# Altium schematic sheet digital.SchDoc
size B; SheetNumber: 2; SheetTotal: 3
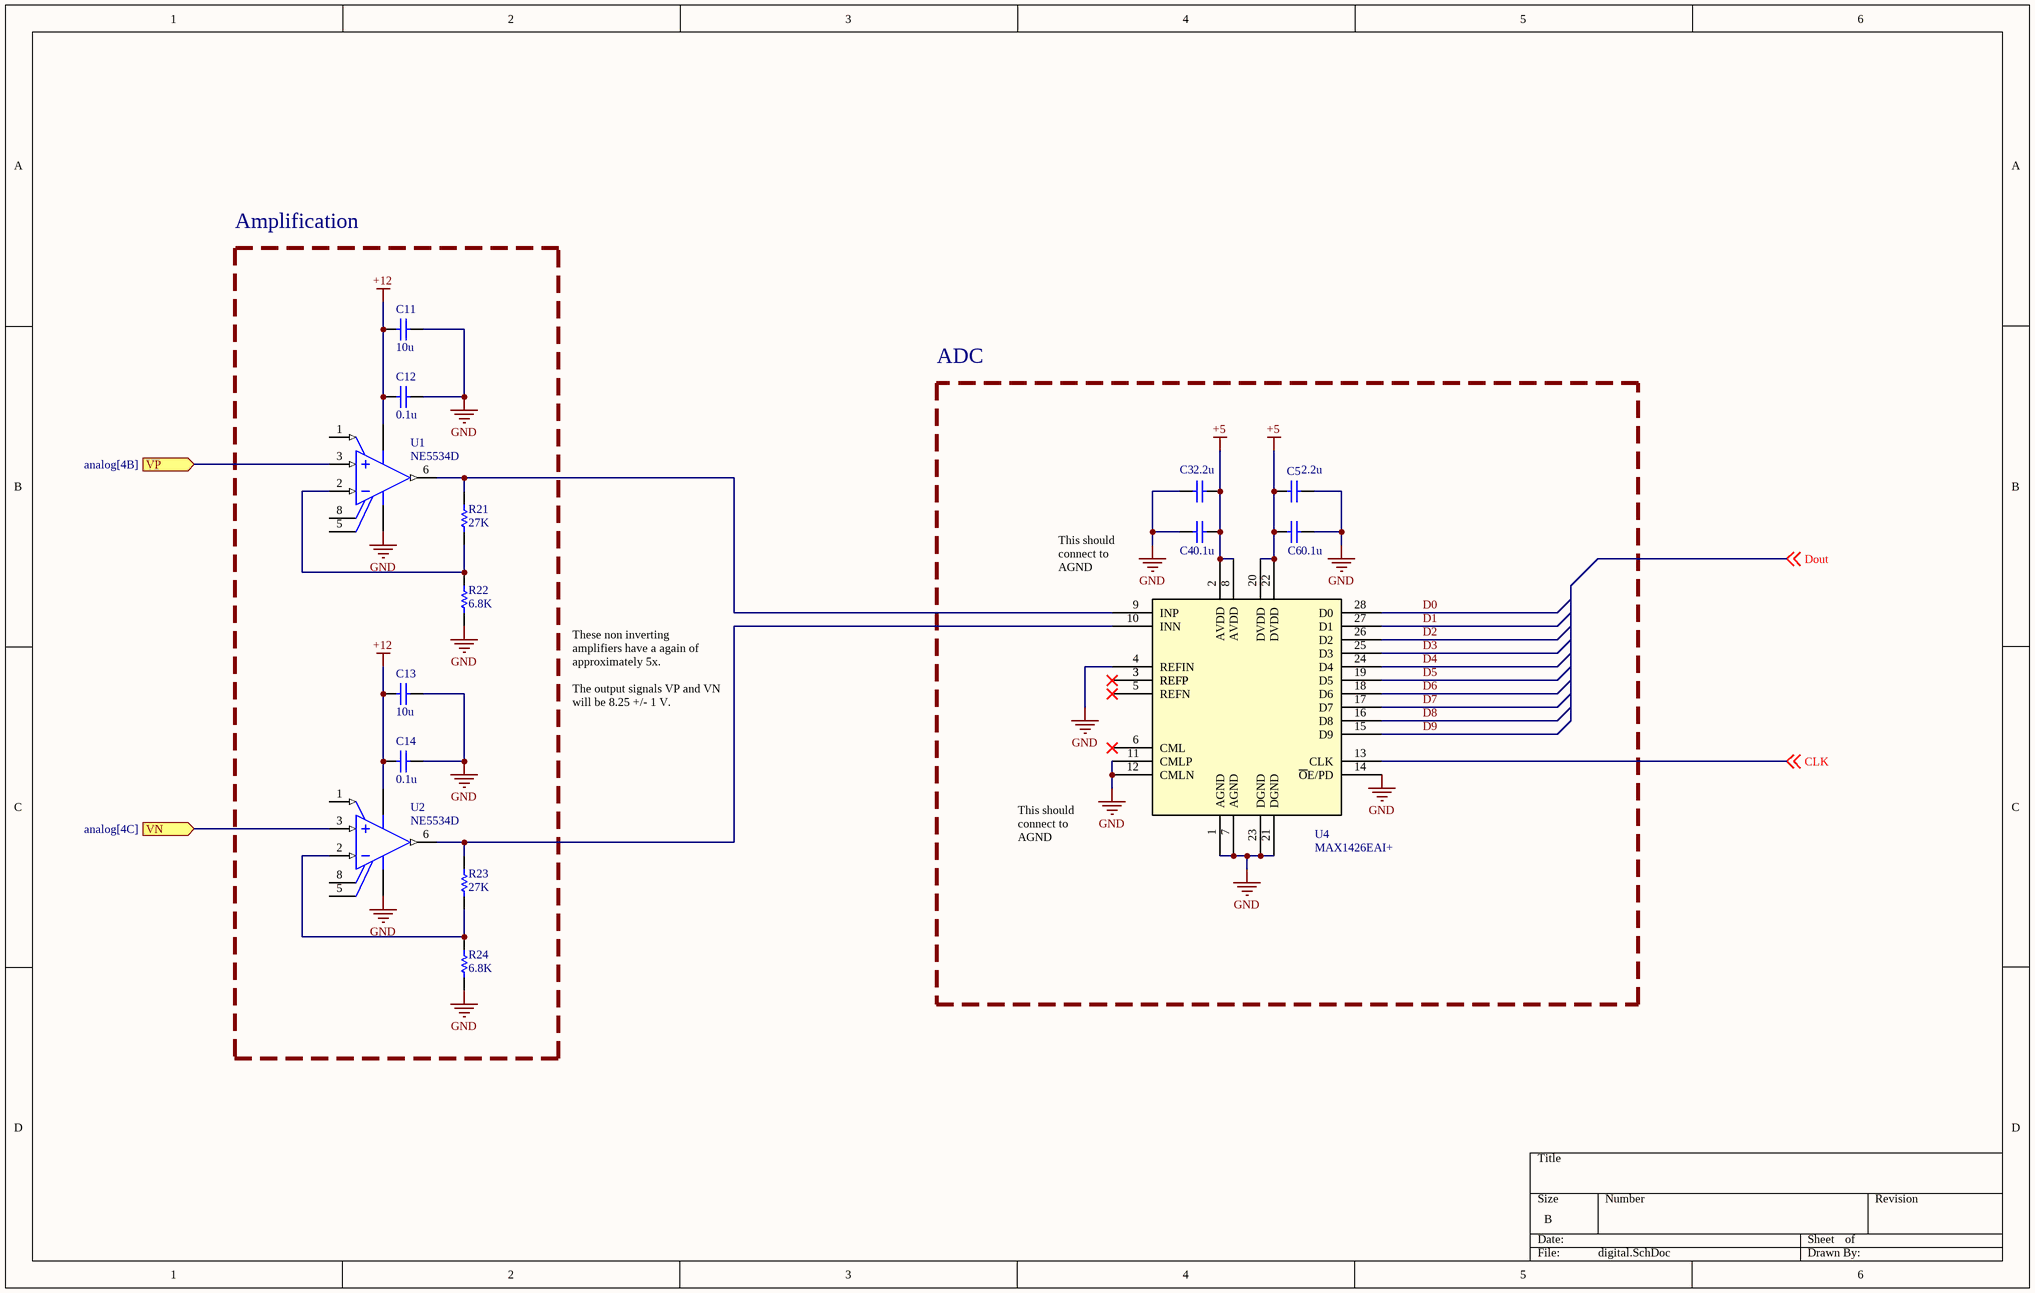
[diagram p0: digital.SchDoc]

## Parts
C3  value 2.2u  (hidden comment: Capacitor)
C4  value 0.1u  (hidden comment: Capacitor)
C5  value 2.2u  (hidden comment: Capacitor)
C6  value 0.1u  (hidden comment: Capacitor)
C11  value 10u  (hidden comment: Capacitor)
C12  value 0.1u  (hidden comment: Capacitor)
C13  value 10u  (hidden comment: Capacitor)
C14  value 0.1u  (hidden comment: Capacitor)
R21  value 27K  (hidden comment: Resistor)
R22  value 6.8K  (hidden comment: Resistor)
R23  value 27K  (hidden comment: Resistor)
R24  value 6.8K  (hidden comment: Resistor)
U1  NE5534D  [D0008A_N]
U2  NE5534D  [D0008A_N]
U4  MAX1426EAI+  [21-0056C_28_MXM]

## Blocks framed on the sheet
Amplification: C11-C14 R21-R24 U1 U2
ADC: C3-C6 U4

## Ports
VN (in, see analog[4C]), VP (in, see analog[4B])

## Nets
+5: C3.2 C4.2 C5.2 C6.2 U4.2(AVDD) U4.8(AVDD) U4.20(DVDD) U4.22(DVDD)
+12: C11.1 C12.1 C13.1 C14.1 U1.4(VCC-) U2.4(VCC-)
GND: C3.1 C4.1 C5.1 C6.1 C11.2 C12.2 C13.2 C14.2 R22.1 R24.1 U1.7(VCC+) U2.7(VCC+) U4.1(AGND) U4.4(REFIN) U4.7(AGND) U4.11(CMLP) U4.12(CMLN) U4.14(~{O}E/PD) U4.21(DGND) U4.23(DGND)
CLK: U4.13(CLK) ; off-sheet CLK
D0: U4.28(D0)
D1: U4.27(D1)
D2: U4.26(D2)
D3: U4.25(D3)
D4: U4.24(D4)
D5: U4.19(D5)
D6: U4.18(D6)
D7: U4.17(D7)
D8: U4.16(D8)
D9: U4.15(D9)
VN: U2.3(IN+) ; port VN
VP: U1.3(IN+) ; port VP
NetR21_1: R21.1 R22.2 U1.2(IN-)
NetR21_2: R21.2 U1.6(OUT) U4.9(INP)
NetR23_1: R23.1 R24.2 U2.2(IN-)
NetR23_2: R23.2 U2.6(OUT) U4.10(INN)

Not connected (* = marked no-connect by the designer): U1 1(BALANCE) 5(COMP) 8(COMP/BAL); U2 1(BALANCE) 5(COMP) 8(COMP/BAL); U4 3(REFP)* 5(REFN)* 6(CML)*

## Notes on the sheet
- (near U4) This should connect to AGND
- These non inverting amplifiers have a again of approximately 5x.
  The output signals VP and VN will be 8.25 +/- 1 V.
- This should connect to AGND
- Labels drawn without touching a wire or pin: Dout

## Library data of the parts
C3-C6 C11-C14 = Capacitor: SimulationGenericComponent: True
R21-R24 = Resistor: TC1: 0; SimulationGenericComponent: True; TC2: 0
U1 U2 = CMP-0017-00431-2: Low-Noise High-Speed Audio Operational Amplifier, 10 to 30 V, 0 to 70 degC, 8-pin SOIC (D8), Green (RoHS & no Sb/Br); Manufacturer: Texas Instruments; Sub Family: General Purpose Amplifier, High Supply Voltage Amplifier (>=30V), Low Noise Amp (<=10nV/rtHz); Total Supply Voltage(Max)(+5V is 5, +/-5V is 10): 30; CMRR(Min)(dB): 70; Number of Channels: 1; IIB(Max)(pA): 1500000; Vio (25C)(Max)(mV): 4; Total Supply Voltage(Min)(+5V is 5, +/-5V is 10): 10; Iq per channel(Max)(mA): 8; Slew Rate(Typ)(V/us): 13; PackageVersion: 4040047-3/M, 06/2011; Mounting Technology: Surface Mount; DatasheetVersion: SLOS070C; ComponentLink1URL: http://www.ti.com/; ComponentLink3Description: Package Specification; Eco-Plan: Green (RoHS & no Sb/Br); ComponentLink3URL: http://www.ti.com/litv/pdf/msoi002j; ComponentLink2URL: http://www.ti.com/lit/ds/symlink/ne5534.pdf; Code_JEDEC: MS-012; PartNumber: NE5534D; ComponentLink2Description: Datasheet; GBW(Typ)(MHz): 10; PackageDescription: 8-Pin Plastic Small Outline, Body 4.9 x 3.9 mm, Pitch 1.27 mm; PackageReference: D0008A; Vn at 1kHz(Typ)(nV/rtHz): 4; ComponentLink1Description: Manufacturer URL
U4 = MAX1426EAI+: No Description Available; Mfr_Name: Analog Devices / Maxim Integrated; RefDes: RefDes; Type: Type